# EAGLE design sunclock (EAGLE 9.6.2)
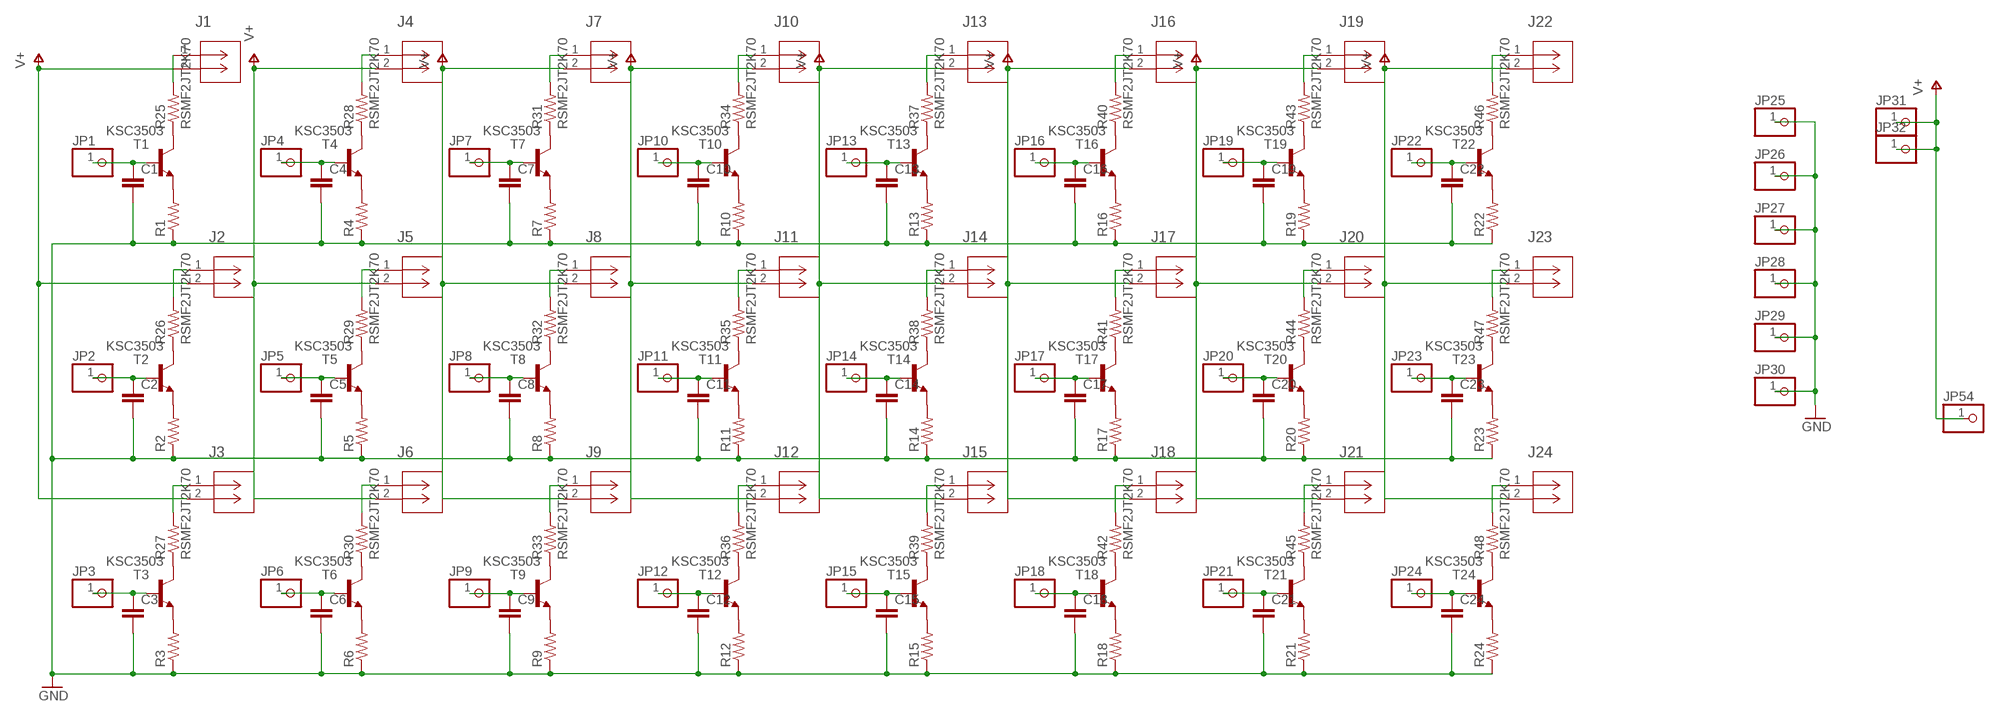
[diagram p0: schematic, sheet 1]

## Parts
C1  C-EU050-025X075  [C050-025X075]
C2  C-EU050-025X075  [C050-025X075]
C3  C-EU050-025X075  [C050-025X075]
C4  C-EU050-025X075  [C050-025X075]
C5  C-EU050-025X075  [C050-025X075]
C6  C-EU050-025X075  [C050-025X075]
C7  C-EU050-025X075  [C050-025X075]
C8  C-EU050-025X075  [C050-025X075]
C9  C-EU050-025X075  [C050-025X075]
C10  C-EU050-025X075  [C050-025X075]
C11  C-EU050-025X075  [C050-025X075]
C12  C-EU050-025X075  [C050-025X075]
C13  C-EU050-025X075  [C050-025X075]
C14  C-EU050-025X075  [C050-025X075]
C15  C-EU050-025X075  [C050-025X075]
C16  C-EU050-025X075  [C050-025X075]
C17  C-EU050-025X075  [C050-025X075]
C18  C-EU050-025X075  [C050-025X075]
C19  C-EU050-025X075  [C050-025X075]
C20  C-EU050-025X075  [C050-025X075]
C21  C-EU050-025X075  [C050-025X075]
C22  C-EU050-025X075  [C050-025X075]
C23  C-EU050-025X075  [C050-025X075]
C24  C-EU050-025X075  [C050-025X075]
J1  1776275-2  [CONN2_1776275-2]
J2  1776275-2  [CONN2_1776275-2]
J3  1776275-2  [CONN2_1776275-2]
J4  1776275-2  [CONN2_1776275-2]
J5  1776275-2  [CONN2_1776275-2]
J6  1776275-2  [CONN2_1776275-2]
J7  1776275-2  [CONN2_1776275-2]
J8  1776275-2  [CONN2_1776275-2]
J9  1776275-2  [CONN2_1776275-2]
J10  1776275-2  [CONN2_1776275-2]
J11  1776275-2  [CONN2_1776275-2]
J12  1776275-2  [CONN2_1776275-2]
J13  1776275-2  [CONN2_1776275-2]
J14  1776275-2  [CONN2_1776275-2]
J15  1776275-2  [CONN2_1776275-2]
J16  1776275-2  [CONN2_1776275-2]
J17  1776275-2  [CONN2_1776275-2]
J18  1776275-2  [CONN2_1776275-2]
J19  1776275-2  [CONN2_1776275-2]
J20  1776275-2  [CONN2_1776275-2]
J21  1776275-2  [CONN2_1776275-2]
J22  1776275-2  [CONN2_1776275-2]
J23  1776275-2  [CONN2_1776275-2]
J24  1776275-2  [CONN2_1776275-2]
JP1  PINHD-1X1  [1X01]
JP2  PINHD-1X1  [1X01]
JP3  PINHD-1X1  [1X01]
JP4  PINHD-1X1  [1X01]
JP5  PINHD-1X1  [1X01]
JP6  PINHD-1X1  [1X01]
JP7  PINHD-1X1  [1X01]
JP8  PINHD-1X1  [1X01]
JP9  PINHD-1X1  [1X01]
JP10  PINHD-1X1  [1X01]
JP11  PINHD-1X1  [1X01]
JP12  PINHD-1X1  [1X01]
JP13  PINHD-1X1  [1X01]
JP14  PINHD-1X1  [1X01]
JP15  PINHD-1X1  [1X01]
JP16  PINHD-1X1  [1X01]
JP17  PINHD-1X1  [1X01]
JP18  PINHD-1X1  [1X01]
JP19  PINHD-1X1  [1X01]
JP20  PINHD-1X1  [1X01]
JP21  PINHD-1X1  [1X01]
JP22  PINHD-1X1  [1X01]
JP23  PINHD-1X1  [1X01]
JP24  PINHD-1X1  [1X01]
JP25  PINHD-1X1  [1X01]
JP26  PINHD-1X1  [1X01]
JP27  PINHD-1X1  [1X01]
JP28  PINHD-1X1  [1X01]
JP29  PINHD-1X1  [1X01]
JP30  PINHD-1X1  [1X01]
JP31  PINHD-1X1  [1X01]
JP32  PINHD-1X1  [1X01]
JP54  PINHD-1X1  [1X01]
R1  R-US_0207/10  [0207/10]
R2  R-US_0207/10  [0207/10]
R3  R-US_0207/10  [0207/10]
R4  R-US_0207/10  [0207/10]
R5  R-US_0207/10  [0207/10]
R6  R-US_0207/10  [0207/10]
R7  R-US_0207/10  [0207/10]
R8  R-US_0207/10  [0207/10]
R9  R-US_0207/10  [0207/10]
R10  R-US_0207/10  [0207/10]
R11  R-US_0207/10  [0207/10]
R12  R-US_0207/10  [0207/10]
R13  R-US_0207/10  [0207/10]
R14  R-US_0207/10  [0207/10]
R15  R-US_0207/10  [0207/10]
R16  R-US_0207/10  [0207/10]
R17  R-US_0207/10  [0207/10]
R18  R-US_0207/10  [0207/10]
R19  R-US_0207/10  [0207/10]
R20  R-US_0207/10  [0207/10]
R21  R-US_0207/10  [0207/10]
R22  R-US_0207/10  [0207/10]
R23  R-US_0207/10  [0207/10]
R24  R-US_0207/10  [0207/10]
R25  RSMF2JT2K70  [RESAD1610W80L1100D450B]
R26  RSMF2JT2K70  [RESAD1610W80L1100D450B]
R27  RSMF2JT2K70  [RESAD1610W80L1100D450B]
R28  RSMF2JT2K70  [RESAD1610W80L1100D450B]
R29  RSMF2JT2K70  [RESAD1610W80L1100D450B]
R30  RSMF2JT2K70  [RESAD1610W80L1100D450B]
R31  RSMF2JT2K70  [RESAD1610W80L1100D450B]
R32  RSMF2JT2K70  [RESAD1610W80L1100D450B]
R33  RSMF2JT2K70  [RESAD1610W80L1100D450B]
R34  RSMF2JT2K70  [RESAD1610W80L1100D450B]
R35  RSMF2JT2K70  [RESAD1610W80L1100D450B]
R36  RSMF2JT2K70  [RESAD1610W80L1100D450B]
R37  RSMF2JT2K70  [RESAD1610W80L1100D450B]
R38  RSMF2JT2K70  [RESAD1610W80L1100D450B]
R39  RSMF2JT2K70  [RESAD1610W80L1100D450B]
R40  RSMF2JT2K70  [RESAD1610W80L1100D450B]
R41  RSMF2JT2K70  [RESAD1610W80L1100D450B]
R42  RSMF2JT2K70  [RESAD1610W80L1100D450B]
R43  RSMF2JT2K70  [RESAD1610W80L1100D450B]
R44  RSMF2JT2K70  [RESAD1610W80L1100D450B]
R45  RSMF2JT2K70  [RESAD1610W80L1100D450B]
R46  RSMF2JT2K70  [RESAD1610W80L1100D450B]
R47  RSMF2JT2K70  [RESAD1610W80L1100D450B]
R48  RSMF2JT2K70  [RESAD1610W80L1100D450B]
T1  KSC3503  [TO126V_]
T2  KSC3503  [TO126V_]
T3  KSC3503  [TO126V_]
T4  KSC3503  [TO126V_]
T5  KSC3503  [TO126V_]
T6  KSC3503  [TO126V_]
T7  KSC3503  [TO126V_]
T8  KSC3503  [TO126V_]
T9  KSC3503  [TO126V_]
T10  KSC3503  [TO126V_]
T11  KSC3503  [TO126V_]
T12  KSC3503  [TO126V_]
T13  KSC3503  [TO126V_]
T14  KSC3503  [TO126V_]
T15  KSC3503  [TO126V_]
T16  KSC3503  [TO126V_]
T17  KSC3503  [TO126V_]
T18  KSC3503  [TO126V_]
T19  KSC3503  [TO126V_]
T20  KSC3503  [TO126V_]
T21  KSC3503  [TO126V_]
T22  KSC3503  [TO126V_]
T23  KSC3503  [TO126V_]
T24  KSC3503  [TO126V_]

## Nets
GND: C1.2 C2.2 C3.2 C4.2 C5.2 C6.2 C7.2 C8.2 C9.2 C10.2 C11.2 C12.2 C13.2 C14.2 C15.2 C16.2 C17.2 C18.2 C19.2 C20.2 C21.2 C22.2 C23.2 C24.2 JP25.1 JP26.1 JP27.1 JP28.1 JP29.1 JP30.1 R1.1 R2.1 R3.1 R4.1 R5.1 R6.1 R7.1 R8.1 R9.1 R10.1 R11.1 R12.1 R13.1 R14.1 R15.1 R16.1 R17.1 R18.1 R19.1 R20.1 R21.1 R22.1 R23.1 R24.1
N$1: C1.1 JP1.1 T1.3(B)
N$2: R1.2 T1.1(E)
N$3: R25.1 T1.2(C)
N$4: J1.1 R25.2
N$5: R2.2 T2.1(E)
N$6: C2.1 JP2.1 T2.3(B)
N$7: R26.1 T2.2(C)
N$8: J2.1 R26.2
N$9: C3.1 JP3.1 T3.3(B)
N$10: R3.2 T3.1(E)
N$11: R27.1 T3.2(C)
N$12: J3.1 R27.2
N$13: J4.1 R28.2
N$14: J5.1 R29.2
N$15: J6.1 R30.2
N$16: R28.1 T4.2(C)
N$17: R29.1 T5.2(C)
N$18: R30.1 T6.2(C)
N$19: R4.2 T4.1(E)
N$20: R5.2 T5.1(E)
N$21: R6.2 T6.1(E)
N$22: C5.1 JP5.1 T5.3(B)
N$23: C4.1 JP4.1 T4.3(B)
N$24: C6.1 JP6.1 T6.3(B)
N$25: R7.2 T7.1(E)
N$26: R8.2 T8.1(E)
N$27: R9.2 T9.1(E)
N$28: R31.1 T7.2(C)
N$29: R32.1 T8.2(C)
N$30: R33.1 T9.2(C)
N$31: J9.1 R33.2
N$32: J8.1 R32.2
N$33: J7.1 R31.2
N$34: C7.1 JP7.1 T7.3(B)
N$35: R10.2 T10.1(E)
N$36: C8.1 JP8.1 T8.3(B)
N$37: R11.2 T11.1(E)
N$38: C9.1 JP9.1 T9.3(B)
N$39: R12.2 T12.1(E)
N$40: R34.1 T10.2(C)
N$41: R35.1 T11.2(C)
N$42: R36.1 T12.2(C)
N$43: J10.1 R34.2
N$44: J11.1 R35.2
N$45: J12.1 R36.2
N$46: C10.1 JP10.1 T10.3(B)
N$47: C11.1 JP11.1 T11.3(B)
N$48: C12.1 JP12.1 T12.3(B)
N$49: R13.2 T13.1(E)
N$50: R14.2 T14.1(E)
N$51: R15.2 T15.1(E)
N$52: R37.1 T13.2(C)
N$53: R38.1 T14.2(C)
N$54: R39.1 T15.2(C)
N$55: J15.1 R39.2
N$56: J14.1 R38.2
N$57: J13.1 R37.2
N$58: C13.1 JP13.1 T13.3(B)
N$59: C14.1 JP14.1 T14.3(B)
N$60: C15.1 JP15.1 T15.3(B)
N$61: R16.2 T16.1(E)
N$62: R17.2 T17.1(E)
N$63: R18.2 T18.1(E)
N$64: R40.1 T16.2(C)
N$65: R41.1 T17.2(C)
N$66: R42.1 T18.2(C)
N$67: J16.1 R40.2
N$68: J17.1 R41.2
N$69: J18.1 R42.2
N$70: C16.1 JP16.1 T16.3(B)
N$71: C17.1 JP17.1 T17.3(B)
N$72: C18.1 JP18.1 T18.3(B)
N$73: R19.2 T19.1(E)
N$74: R20.2 T20.1(E)
N$75: R21.2 T21.1(E)
N$76: R43.1 T19.2(C)
N$77: R44.1 T20.2(C)
N$78: R45.1 T21.2(C)
N$79: J21.1 R45.2
N$80: J20.1 R44.2
N$81: J19.1 R43.2
N$82: C19.1 JP19.1 T19.3(B)
N$83: C20.1 JP20.1 T20.3(B)
N$84: C21.1 JP21.1 T21.3(B)
N$85: R22.2 T22.1(E)
N$86: R23.2 T23.1(E)
N$87: R24.2 T24.1(E)
N$88: R46.1 T22.2(C)
N$89: R47.1 T23.2(C)
N$90: R48.1 T24.2(C)
N$91: J22.1 R46.2
N$93: J23.1 R47.2
N$94: J24.1 R48.2
N$95: C24.1 JP24.1 T24.3(B)
N$96: C23.1 JP23.1 T23.3(B)
N$97: C22.1 JP22.1 T22.3(B)
V+: J1.2 J2.2 J3.2 J4.2 J5.2 J6.2 J7.2 J8.2 J9.2 J10.2 J11.2 J12.2 J13.2 J14.2 J15.2 J16.2 J17.2 J18.2 J19.2 J20.2 J21.2 J22.2 J23.2 J24.2 JP31.1 JP32.1 JP54.1

## Library data of the parts
C1-C24 = 1826899:C-EU: CAPACITOR, European symbol; SPICEPREFIX: C
J1-J24 = 1826899:1776275-2; COPYRIGHT: Copyright (C) 2023 Ultra Librarian. All rights reserved.; MANUFACTURER_PART_NUMBER: 1776275-2; MFR_NAME: TE Connectivity; TYPE: Receptacle
JP1-JP32 JP54 = 1826899:PINHD-1X1: PIN HEADER
R1-R24 = 1826899:R-US_: RESISTOR, American symbol; SPICEPREFIX: R
R25-R48 = 1826899:RSMF2JT2K70
T1-T24 = 1826899:KSC3503

## Board
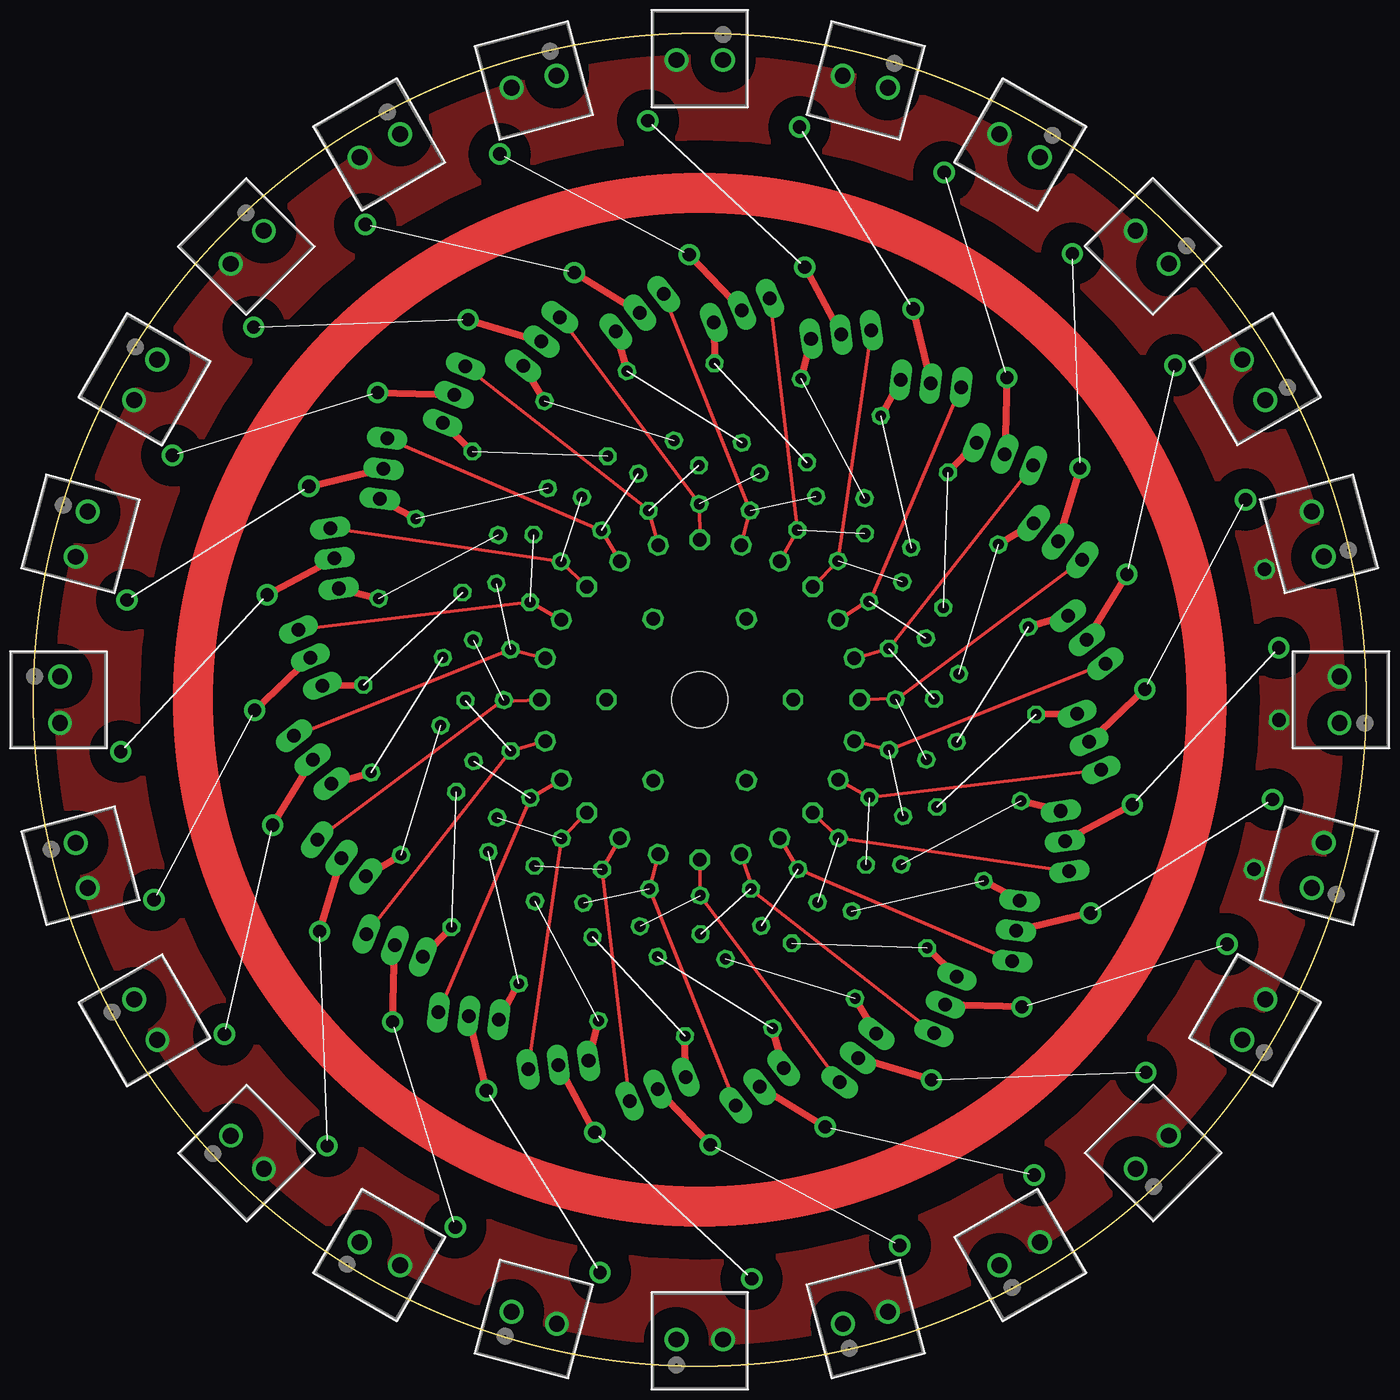
[diagram p1: board, top side]
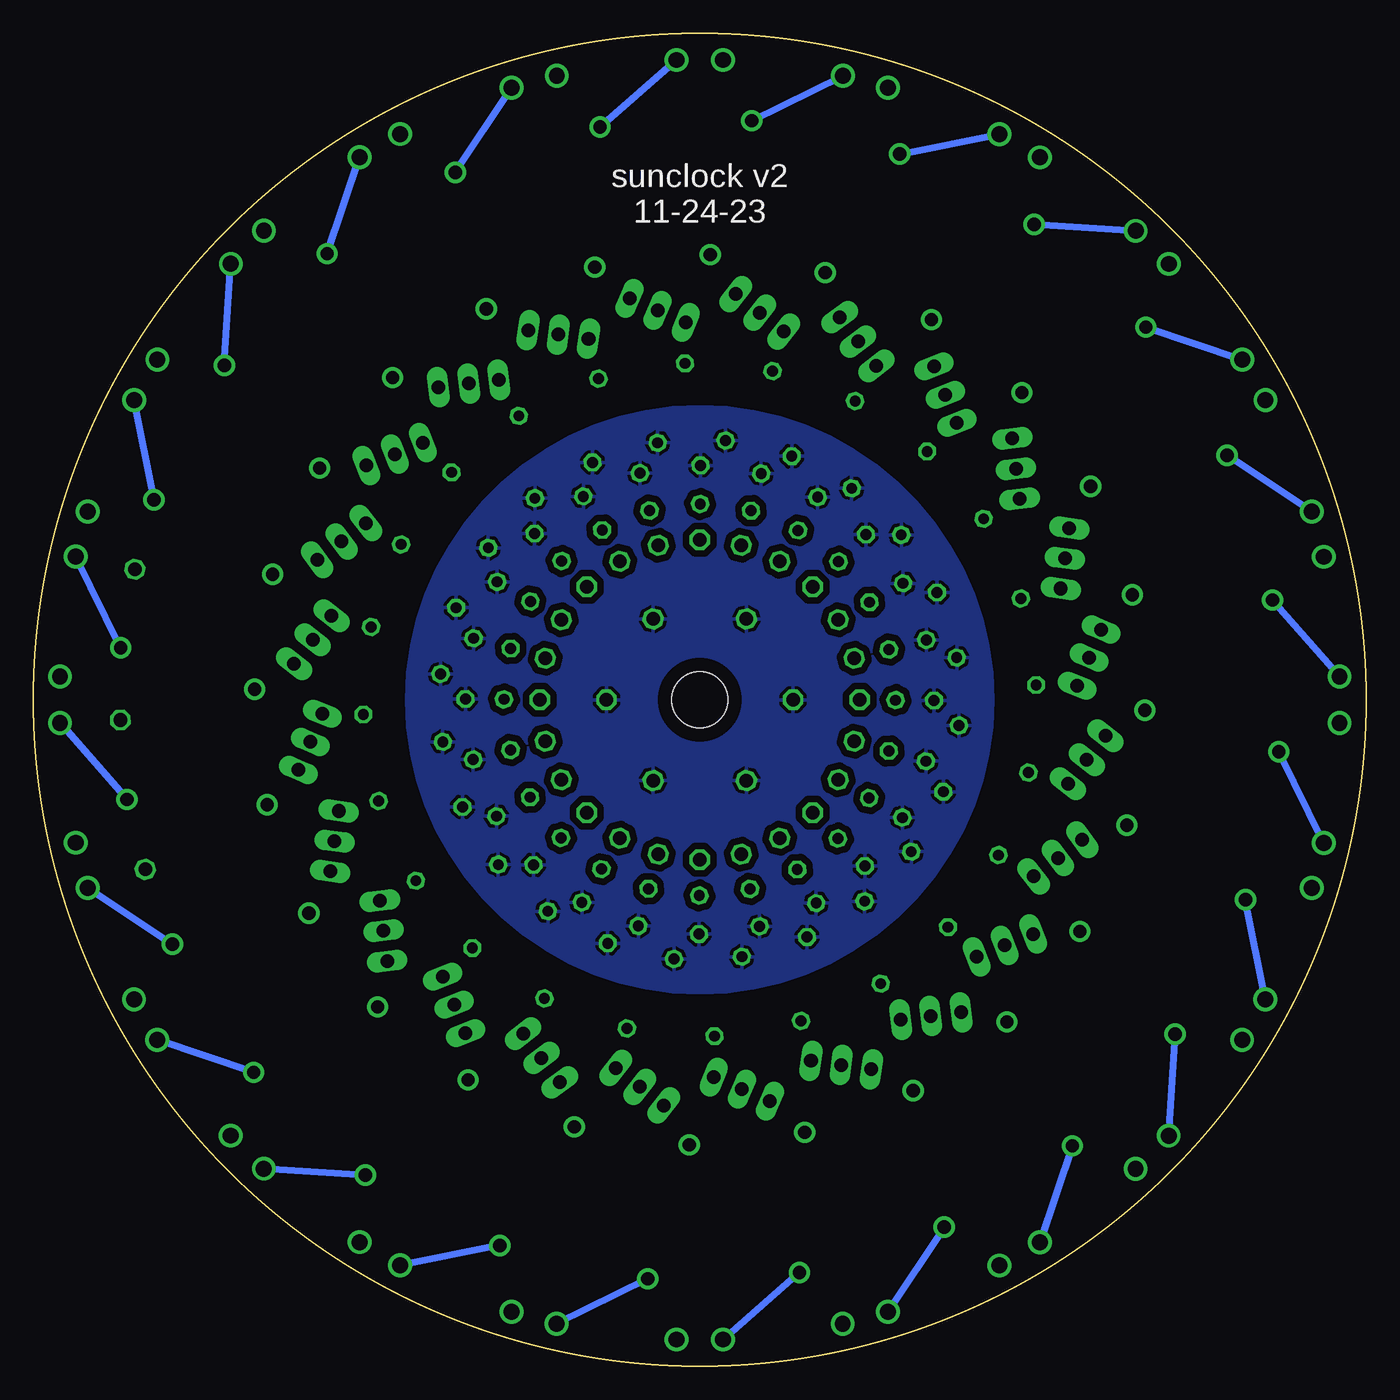
[diagram p2: board, bottom side, seen from below]

Size 100 x 100 mm. Coordinates in mm from the lower left corner, seen from the top.
Outline: circle at 50,50 radius 50
Copper layers (1*16): Top 0.035mm / dielectric 1.5mm / Bottom 0.035mm
Design rules "default": minimum track width 6mil, minimum drill 0.35mm, track to track 6mil, track to pad 6mil, pad to pad 6mil, via to via 6mil, smd to smd 6mil, copper to edge 40mil, drill to drill 6mil, minimum pad ring 10mil, minimum via ring 8mil, stop-mask expansion 4mil, vias tented up to drill 0mil, thermal gap 10mil
Holes 4.2 mm at 50,50

### Footprints (pad centres in the part's own frame; a part is rotated, then mirrored left to right if it is on the bottom)
C050-025X075 = drill 0.813 octagon: 1 -2.54,0; 2 2.54,0
CONN2_1776275-2 = drill 1.194 pad 1.702: 1 -1.75,0; 2 1.755,0
1X01 = drill 1.016 octagon: 1 0,0
0207/10 = drill 0.813 octagon: 1 -5.08,0; 2 5.08,0
RESAD1610W80L1100D450B = drill 1 pad 1.6: 1 -8.05,0; 2 8.05,0
TO126V_ = drill 1.016 long: 1 -2.286,-1.27; 2 0,-1.27; 3 2.286,-1.27

### Placement (x,y rotation side)
C1  55.99,35.17 237 top
C2  59.63,37.22 252 top
C3  62.61,40.15 267 top
C4  64.73,43.75 282 top
C5  65.84,47.77 297 top
C6  65.88,51.95 312 top
C7  64.83,55.99 327 top
C8  62.78,59.63 342 top
C9  59.85,62.61 357 top
C10  56.25,64.73 12 top
C11  52.23,65.84 27 top
C12  48.05,65.88 42 top
C13  44.01,64.83 57 top
C14  40.37,62.78 72 top
C15  37.39,59.85 87 top
C16  35.27,56.25 102 top
C17  34.16,52.23 117 top
C18  34.12,48.05 132 top
C19  35.17,44.01 147 top
C20  37.22,40.37 162 top
C21  40.15,37.39 177 top
C22  43.75,35.27 192 top
C23  47.77,34.16 207 top
C24  51.95,34.12 222 top
J1  98,50 90 top
J2  96.36,62.42 105 top
J3  91.57,74 120 top
J4  83.94,83.94 135 top
J5  74,91.57 150 top
J6  62.42,96.36 165 top
J7  50,98 180 top
J8  37.58,96.36 195 top
J9  26,91.57 210 top
J10  16.06,83.94 225 top
J11  8.43,74 240 top
J12  3.64,62.42 255 top
J13  2,50 270 top
J14  3.64,37.58 285 top
J15  8.43,26 300 top
J16  16.06,16.06 315 top
J17  26,8.43 330 top
J18  37.58,3.64 345 top
J19  50,2 0 top
J20  62.42,3.64 15 top
J21  74,8.43 30 top
J22  83.94,16.06 45 top
J23  91.57,26 60 top
J24  96.36,37.58 75 top
JP1  56,39.61 300 top
JP2  58.49,41.51 315 top
JP3  60.39,44 330 top
JP4  61.59,46.89 345 top
JP5  62,50 0 top
JP6  61.59,53.11 15 top
JP7  60.39,56 30 top
JP8  58.49,58.49 45 top
JP9  56,60.39 60 top
JP10  53.11,61.59 75 top
JP11  50,62 90 top
JP12  46.89,61.59 105 top
JP13  44,60.39 120 top
JP14  41.51,58.49 135 top
JP15  39.61,56 150 top
JP16  38.41,53.11 165 top
JP17  38,50 180 top
JP18  38.41,46.89 195 top
JP19  39.61,44 210 top
JP20  41.51,41.51 225 top
JP21  44,39.61 240 top
JP22  46.89,38.41 255 top
JP23  50,38 270 top
JP24  53.11,38.41 285 top
JP25  57,50 0 top
JP26  53.5,56.06 60 top
JP27  46.5,56.06 120 top
JP28  43,50 180 top
JP29  46.5,43.94 240 top
JP30  53.5,43.94 300 top
JP31  93.47,48.48 358 top
JP32  92.39,59.79 13 top
JP54  91.6,37.28 343 top
R1  66.35,35.28 13 top
R2  69.6,40.01 28 top
R3  71.52,45.43 43 top
R4  71.97,51.15 58 top
R5  70.92,56.8 73 top
R6  68.45,61.98 88 top
R7  64.72,66.35 103 top
R8  59.99,69.6 118 top
R9  54.57,71.52 133 top
R10  48.85,71.97 148 top
R11  43.2,70.92 163 top
R12  38.02,68.45 178 top
R13  33.65,64.72 193 top
R14  30.4,59.99 208 top
R15  28.48,54.57 223 top
R16  28.03,48.85 238 top
R17  29.08,43.2 253 top
R18  31.55,38.02 268 top
R19  35.28,33.65 283 top
R20  40.01,30.4 298 top
R21  45.43,28.48 313 top
R22  51.15,28.03 328 top
R23  56.8,29.08 343 top
R24  61.98,31.55 358 top
R25  86.14,38.26 32 top
R26  87.95,48.01 47 top
R27  87.17,57.9 62 top
R28  83.86,67.25 77 top
R29  78.24,75.43 92 top
R30  70.7,81.87 107 top
R31  61.74,86.14 122 top
R32  51.99,87.95 137 top
R33  42.1,87.17 152 top
R34  32.75,83.86 167 top
R35  24.57,78.24 182 top
R36  18.13,70.7 197 top
R37  13.86,61.74 212 top
R38  12.05,51.99 227 top
R39  12.83,42.1 242 top
R40  16.14,32.75 257 top
R41  21.76,24.57 272 top
R42  29.3,18.13 287 top
R43  38.26,13.86 302 top
R44  48.01,12.05 317 top
R45  57.9,12.83 332 top
R46  67.25,16.14 347 top
R47  75.43,21.76 2 top
R48  81.87,29.3 17 top
T1  74.98,32.51 263 top
T2  78.66,39.57 278 top
T3  80.38,47.34 293 top
T4  80.04,55.3 308 top
T5  77.64,62.89 323 top
T6  73.36,69.61 338 top
T7  67.49,74.98 353 top
T8  60.43,78.66 8 top
T9  52.66,80.38 23 top
T10  44.7,80.04 38 top
T11  37.11,77.64 53 top
T12  30.39,73.36 68 top
T13  25.02,67.49 83 top
T14  21.34,60.43 98 top
T15  19.62,52.66 113 top
T16  19.96,44.7 128 top
T17  22.36,37.11 143 top
T18  26.64,30.39 158 top
T19  32.51,25.02 173 top
T20  39.57,21.34 188 top
T21  47.34,19.62 203 top
T22  55.3,19.96 218 top
T23  62.89,22.36 233 top
T24  69.61,26.64 248 top

### Tracks (layer width: path | path; a pad name or v marks a point on that pad's centre or on a via)
GND
  pour Bottom (isolate 0.508, rank 2): 72,50 arc90 50,72 arc90 28,50 arc90 50,28 arc90
N$1
  Top 0.254: T1.3 C1.1 JP1.1
N$2
  Top 0.508: T1.1 R1.2
N$3
  Top 0.508: R25.1 T1.2
N$4
  Bottom 0.508: R25.2 J1.1
N$5
  Top 0.508: T2.1 R2.2
N$6
  Top 0.254: T2.3 C2.1 JP2.1
N$7
  Top 0.508: R26.1 T2.2
N$8
  Bottom 0.508: R26.2 J2.1
N$9
  Top 0.254: T3.3 C3.1 JP3.1
N$10
  Top 0.508: T3.1 R3.2
N$11
  Top 0.508: R27.1 T3.2
N$12
  Bottom 0.508: R27.2 J3.1
N$13
  Bottom 0.508: R28.2 J4.1
N$14
  Bottom 0.508: R29.2 J5.1
N$15
  Bottom 0.508: R30.2 J6.1
N$16
  Top 0.508: R28.1 T4.2
N$17
  Top 0.508: R29.1 T5.2
N$18
  Top 0.508: R30.1 T6.2
N$19
  Top 0.508: T4.1 R4.2
N$20
  Top 0.508: T5.1 R5.2
N$21
  Top 0.508: T6.1 R6.2
N$22
  Top 0.254: C5.1 64.9,50.13 | 64.9,50.13 T5.3 | JP5.1 64.9,50.13
N$23
  Top 0.254: T4.3 C4.1 JP4.1
N$24
  Top 0.254: T6.3 C6.1 JP6.1
N$25
  Top 0.508: T7.1 R7.2
N$26
  Top 0.508: T8.1 R8.2
N$27
  Top 0.508: T9.1 R9.2
N$28
  Top 0.508: R31.1 T7.2
N$29
  Top 0.508: R32.1 T8.2
N$30
  Top 0.508: R33.1 T9.2
N$31
  Bottom 0.508: R33.2 J9.1
N$32
  Bottom 0.508: R32.2 J8.1
N$33
  Bottom 0.508: R31.2 J7.1
N$34
  Top 0.254: C7.1 62.84,57.57 | 62.84,57.57 T7.3 | JP7.1 62.84,57.57
N$35
  Top 0.508: T10.1 R10.2
N$36
  Top 0.254: T8.3 C8.1 JP8.1
N$37
  Top 0.508: T11.1 R11.2
N$38
  Top 0.254: T9.3 C9.1 JP9.1
N$39
  Top 0.508: T12.1 R12.2
N$40
  Top 0.508: R34.1 T10.2
N$41
  Top 0.508: R35.1 T11.2
N$42
  Top 0.508: R36.1 T12.2
N$43
  Bottom 0.508: R34.2 J10.1
N$44
  Bottom 0.508: R35.2 J11.1
N$45
  Bottom 0.508: J12.1 R36.2
N$46
  Top 0.254: T10.3 C10.1 JP10.1
N$47
  Top 0.254: T11.3 C11.1 JP11.1
N$48
  Top 0.254: T12.3 45.94,64.42 C12.1 JP12.1
N$49
  Top 0.508: T13.1 R13.2
N$50
  Top 0.508: T14.1 R14.2
N$51
  Top 0.508: T15.1 R15.2
N$52
  Top 0.508: R37.1 T13.2
N$53
  Top 0.508: R38.1 T14.2
N$54
  Top 0.508: R39.1 T15.2
N$55
  Bottom 0.508: J15.1 R39.2
N$56
  Bottom 0.508: J14.1 R38.2
N$57
  Bottom 0.508: J13.1 R37.2
N$58
  Top 0.254: T13.3 C13.1 JP13.1
N$59
  Top 0.254: T14.3 C14.1 JP14.1
N$60
  Top 0.254: T15.3 C15.1 JP15.1
N$61
  Top 0.508: T16.1 R16.2
N$62
  Top 0.508: T17.1 R17.2
N$63
  Top 0.508: T18.1 R18.2
N$64
  Top 0.508: R40.1 T16.2
N$65
  Top 0.508: R41.1 T17.2
N$66
  Top 0.508: R42.1 T18.2
N$67
  Bottom 0.508: J16.1 R40.2
N$68
  Bottom 0.508: R41.2 J17.1
N$69
  Bottom 0.508: R42.2 J18.1
N$70
  Top 0.254: T16.3 C16.1 JP16.1
N$71
  Top 0.254: C17.1 35.1,49.87 | 35.1,49.87 T17.3 | JP17.1 35.1,49.87
N$72
  Top 0.254: T18.3 C18.1 JP18.1
N$73
  Top 0.508: T19.1 R19.2
N$74
  Top 0.508: T20.1 R20.2
N$75
  Top 0.508: T21.1 R21.2
N$76
  Top 0.508: R43.1 T19.2
N$77
  Top 0.508: R44.1 T20.2
N$78
  Top 0.508: R45.1 T21.2
N$79
  Bottom 0.508: R45.2 J21.1
N$80
  Bottom 0.508: R44.2 J20.1
N$81
  Bottom 0.508: R43.2 J19.1
N$82
  Top 0.254: T19.3 C19.1 JP19.1
N$83
  Top 0.254: T20.3 C20.1 JP20.1
N$84
  Top 0.254: T21.3 C21.1 JP21.1
N$85
  Top 0.508: T22.1 R22.2
N$86
  Top 0.508: T23.1 R23.2
N$87
  Top 0.508: T24.1 R24.2
N$88
  Top 0.508: R46.1 T22.2
N$89
  Top 0.508: R47.1 T23.2
N$90
  Top 0.508: R48.1 T24.2
N$91
  Bottom 0.508: R46.2 J22.1
N$93
  Bottom 0.508: R47.2 J23.1
N$94
  Bottom 0.508: R48.2 J24.1
N$95
  Top 0.254: C24.1 54.06,35.58 | 54.06,35.58 T24.3 | JP24.1 54.06,35.58
N$96
  Top 0.254: T23.3 C23.1 JP23.1
N$97
  Top 0.254: T22.3 C22.1 JP22.1
V+
  pour Top (isolate 1.524, no thermals): 100,50 arc90 50,100 arc90 0,50 arc90 50,0 arc90
  cutout Top (isolate 0.635): 92,50 arc90 50,92 arc90 8,50 arc90 50,8 arc90
(copper drawn outside any net)
  shapes: Top circle x1

### Text on the board
bNames: sunclock v2 / 11-24-23